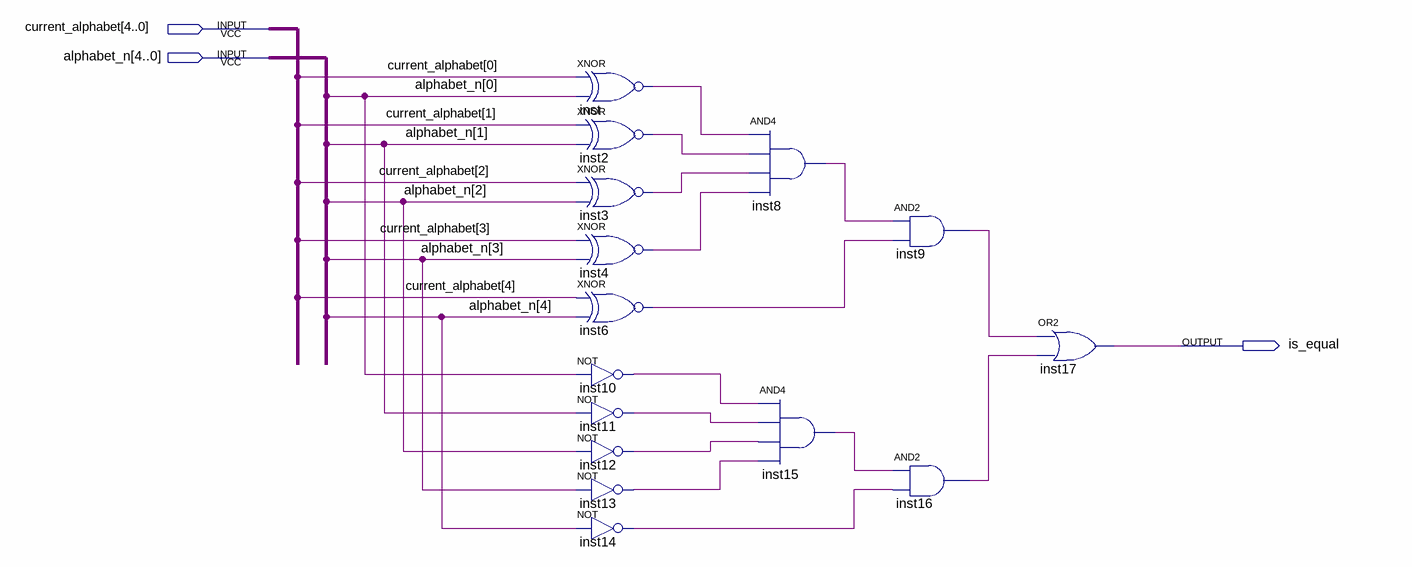
[diagram p0: schematic sheet]
// Quartus schematic checker.bdf as structural Verilog: 15 symbols, 3 pins
module \checker  (
  input  [4:0] current_alphabet,
  input  [4:0] alphabet_n,
  output is_equal
);

  wire inst2_out, inst3_out, inst4_out, inst6_out, inst8_out, inst9_out, inst10_out, inst11_out, inst12_out,
       inst13_out, inst14_out, inst15_out, inst16_out, inst_out;

  xnor inst (inst_out, current_alphabet[0], alphabet_n[0]);
  xnor inst2 (inst2_out, current_alphabet[1], alphabet_n[1]);
  xnor inst3 (inst3_out, current_alphabet[2], alphabet_n[2]);
  xnor inst4 (inst4_out, current_alphabet[3], alphabet_n[3]);
  xnor inst6 (inst6_out, current_alphabet[4], alphabet_n[4]);
  not inst10 (inst10_out, alphabet_n[0]);
  not inst11 (inst11_out, alphabet_n[1]);
  not inst12 (inst12_out, alphabet_n[2]);
  not inst13 (inst13_out, alphabet_n[3]);
  not inst14 (inst14_out, alphabet_n[4]);
  and inst8 (inst8_out, inst_out, inst2_out, inst3_out, inst4_out);
  and inst15 (inst15_out, inst10_out, inst11_out, inst12_out, inst13_out);
  and inst9 (inst9_out, inst8_out, inst6_out);
  and inst16 (inst16_out, inst15_out, inst14_out);
  or inst17 (is_equal, inst9_out, inst16_out);
endmodule
